# Altium schematic sheet Sheet2.SchDoc
size A4; SheetNumber: 2; SheetTotal: 2
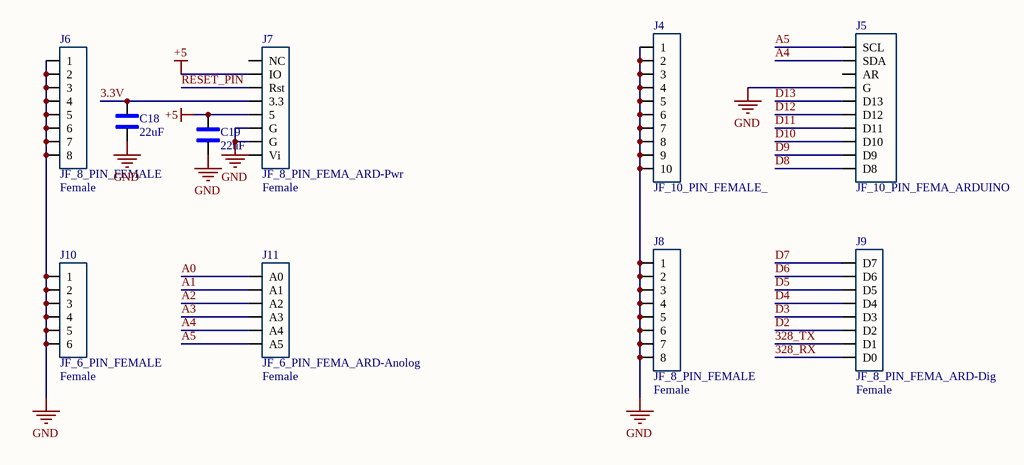
[diagram p0: Sheet2.SchDoc]

## Parts
C18  22uF  [1206_Passive_Capacitor]
C19  22uF  [1206_Passive_Capacitor]
J4  JF_10_PIN_FEMALE_  [10_PIN_100MIL - Female]
J5  JF_10_PIN_FEMA_ARDUINO  [10_PIN_ARDUINO_100MIL]
J6  JF_8_PIN_FEMALE  value Female  [8_PIN_100MIL - Female]
J7  JF_8_PIN_FEMA_ARD-Pwr  value Female  [8_PIN_ARD-PWR_100MIL]
J8  JF_8_PIN_FEMALE  value Female  [8_PIN_100MIL - Female]
J9  JF_8_PIN_FEMA_ARD-Dig  value Female  [8_PIN_ARD-DIG_100MIL]
J10  JF_6_PIN_FEMALE  value Female  [6_PIN_100MIL -Female]
J11  JF_6_PIN_FEMA_ARD-Anolog  value Female  [6_PIN_ARD-Analog_100mil]

## Nets
+5: C19.2 J7.2(IO) J7.5
GND: C18.1 C19.1 J4.1 J4.2 J4.3 J4.4 J4.5 J4.6 J4.7 J4.8 J4.9 J4.10 J5.4(G) J6.1 J6.2 J6.3 J6.4 J6.5 J6.6 J6.7 J6.8 J7.6(G) J7.7(G) J8.1 J8.2 J8.3 J8.4 J8.5 J8.6 J8.7 J8.8 J10.1 J10.2 J10.3 J10.4 J10.5 J10.6
3.3V: C18.2 J7.4(3.3)
328_RX: J9.8(D0)
328_TX: J9.7(D1)
A0: J11.1(A0)
A1: J11.2(A1)
A2: J11.3(A2)
A3: J11.4(A3)
A4: J5.2(SDA) J11.5(A4)
A5: J5.1(SCL) J11.6(A5)
D2: J9.6(D2)
D3: J9.5(D3)
D4: J9.4(D4)
D5: J9.3(D5)
D6: J9.2(D6)
D7: J9.1(D7)
D8: J5.10(D8)
D9: J5.9(D9)
D10: J5.8(D10)
D11: J5.7(D11)
D12: J5.6(D12)
D13: J5.5(D13)
RESET_PIN: J7.3(Rst)

Not connected (* = marked no-connect by the designer): J5 3(AR); J7 1(NC) 8(Vi)

## Library data of the parts
C18 C19 = C_22uF_1206: 22uF ±10% 25V X5R 1206 Multilayer Ceramic Capacitors MLCC - SMD/SMT RoHS; MFR Part #: CL31A226KAHNNNE; Type: basic; LCSC Part#: C12891; Datasheet: https://datasheet.lcsc.com/lcsc/1811031514_Samsung-Electro-Mechanics-CL31A226KAHNNNE_C12891.pdf; Value: 22uF
J4 = CMP-002-00103-1: 10 Position Header Connector 0.100" (2.54mm) Through Hole Tin; MFR Part #: PPTC101LFBN-RC; Value: Female; Digikey Link: https://www.digikey.com/product-detail/en/PPTC101LFBN-RC/S7008-ND/810149/?itemSeq=304982352; Pins: 10; Design Item ID: JF_10_PIN_FEMALE_; Source: ECEN5730Lib_2023_05_DS.SchLib; LCSC Part#: C225507; Type: Extended; Component Type: Standard
J5 = CMP-002-00102-1: 10 Position Header Connector 0.100" (2.54mm) Through Hole Tin; MFR Part #: PPTC101LFBN-RC; Value: Female; Component Type: Standard; LCSC Part#: C225507; Pins: 10; Source: ECEN5730Lib_2023_05_DS.SchLib; Digikey Link: https://www.digikey.com/product-detail/en/PPTC101LFBN-RC/S7008-ND/810149/?itemSeq=304982352; Type: Extended; Design Item ID: JF_10_PIN_FEMA_ARDUINO
J6 J8 = CMP-002-00113-1: 8 Position Header Connector 0.100" (2.54mm) Through Hole Tin; MFR Part #: PPTC081LFBN-RC; Component Type: Standard; Pins: 8; Digikey Link: https://www.digikey.com/product-detail/en/PPTC081LFBN-RC/S7006-ND/810147/?itemSeq=304982354; LCSC Part#: C27438; Type: Extended; Design Item ID: JF_8_PIN_FEMALE; Source: ECEN5730Lib_2023_05_DS.SchLib
J7 = CMP-002-00112-1: 8 Position Header Connector 0.100" (2.54mm) Through Hole Tin; MFR Part #: PPTC081LFBN-RC; LCSC Part#: C27438; Pins: 8; Digikey Link: https://www.digikey.com/product-detail/en/PPTC081LFBN-RC/S7006-ND/810147/?itemSeq=304982354; Component Type: Standard; Source: ECEN5730Lib_2023_05_DS.SchLib; Type: Extended; Design Item ID: JF_8_PIN_FEMA_ARD-Pwr
J9 = CMP-002-00111-1: 8 Position Header Connector 0.100" (2.54mm) Through Hole Tin; MFR Part #: PPTC081LFBN-RC; Component Type: Standard; Design Item ID: JF_8_PIN_FEMA_ARD-Dig; Pins: 8; Type: Extended; Source: ECEN5730Lib_2023_05_DS.SchLib; LCSC Part#: C27438; Digikey Link: https://www.digikey.com/product-detail/en/PPTC081LFBN-RC/S7006-ND/810147/?itemSeq=304982354
J10 = CMP-002-00109-1: 6 Position Header Connector 0.100" (2.54mm) Through Hole Tin; MFR Part #: PPTC061LFBN-RC; Design Item ID: JF_6_PIN_FEMALE; Pins: 6; LCSC Part#: C40877; Type: Extended; Digikey Link: https://www.digikey.com/product-detail/en/PPTC061LFBN-RC/S7004-ND/810145/?itemSeq=304982353; Component Type: Standard; Source: ECEN5730Lib_2023_05_DS.SchLib
J11 = CMP-002-00108-1: 6 Position Header Connector 0.100" (2.54mm) Through Hole Tin; MFR Part #: PPTC061LFBN-RC; Pins: 6; LCSC Part#: C40877; Component Type: Standard; Type: Extended; Design Item ID: JF_6_PIN_FEMA_ARD-Anolog; Source: ECEN5730Lib_2023_05_DS.SchLib; Digikey Link: https://www.digikey.com/product-detail/en/PPTC061LFBN-RC/S7004-ND/810145/?itemSeq=304982353